# Altium schematic sheet LOOMS.SchDoc
size A4; Organization: Electronic Research & Design; Address1: 11 Granofier; Address2: Zwartkop; Address3: Centurion; Address4: South Africa; Revision: 0
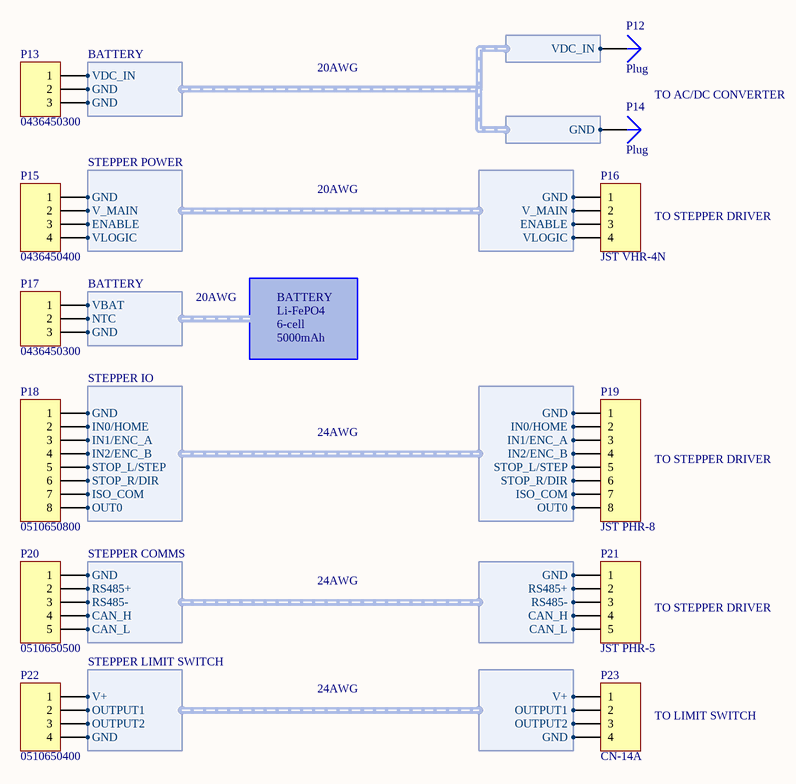
[diagram p0: LOOMS.SchDoc]

## Parts
P12  Plug  [PIN1]
P13  0436450300  [HDR1X3]
P14  Plug  [PIN1]
P15  0436450400  [HDR1X4]
P16  JST VHR-4N  [HDR1X4]
P17  0436450300  [HDR1X3]
P18  0510650800  [HDR1X8]
P19  JST PHR-8  [HDR1X8]
P20  0510650500  [HDR1X5]
P21  JST PHR-5  [HDR1X5]
P22  0510650400  [HDR1X4]
P23  CN-14A  [HDR1X4]

## Harnesses
STEPPER POWER: GND, V_MAIN, ENABLE, VLOGIC
BATTERY: VBAT, NTC, GND
STEPPER IO: OUT0, ISO_COM, STOP_R/DIR, STOP_L/STEP, IN2/ENC_B, IN1/ENC_A, IN0/HOME, GND
STEPPER COMMS: GND, RS485+, RS485-, CAN_H, CAN_L
STEPPER LIMIT SWITCH: V+, OUTPUT1, OUTPUT2, GND
BATTERY: VDC_IN, GND, GND
BATTERY: VDC_IN
BATTERY: GND

## Nets
NetP12_1: P12.1 P13.1 ; harness BATTERY.VDC_IN
NetP13_2: P13.2 P13.3 P14.1 ; harness BATTERY.GND
NetP15_1: P15.1 P16.1 ; harness STEPPER POWER.GND
NetP15_2: P15.2 P16.2 ; harness STEPPER POWER.V_MAIN
NetP15_3: P15.3 P16.3 ; harness STEPPER POWER.ENABLE
NetP15_4: P15.4 P16.4 ; harness STEPPER POWER.VLOGIC
NetP17_1: P17.1 ; harness BATTERY.VBAT
NetP17_2: P17.2 ; harness BATTERY.NTC
NetP17_3: P17.3 ; harness BATTERY.GND
NetP18_1: P18.1 P19.1 ; harness STEPPER IO.GND
NetP18_2: P18.2 P19.2 ; harness STEPPER IO.IN0/HOME
NetP18_3: P18.3 P19.3 ; harness STEPPER IO.IN1/ENC_A
NetP18_4: P18.4 P19.4 ; harness STEPPER IO.IN2/ENC_B
NetP18_5: P18.5 P19.5 ; harness STEPPER IO.STOP_L/STEP
NetP18_6: P18.6 P19.6 ; harness STEPPER IO.STOP_R/DIR
NetP18_7: P18.7 P19.7 ; harness STEPPER IO.ISO_COM
NetP18_8: P18.8 P19.8 ; harness STEPPER IO.OUT0
NetP20_1: P20.1 P21.1 ; harness STEPPER COMMS.GND
NetP20_2: P20.2 P21.2 ; harness STEPPER COMMS.RS485+
NetP20_3: P20.3 P21.3 ; harness STEPPER COMMS.RS485-
NetP20_4: P20.4 P21.4 ; harness STEPPER COMMS.CAN_H
NetP20_5: P20.5 P21.5 ; harness STEPPER COMMS.CAN_L
NetP22_1: P22.1 P23.1 ; harness STEPPER LIMIT SWITCH.V+
NetP22_2: P22.2 P23.2 ; harness STEPPER LIMIT SWITCH.OUTPUT1
NetP22_3: P22.3 P23.3 ; harness STEPPER LIMIT SWITCH.OUTPUT2
NetP22_4: P22.4 P23.4 ; harness STEPPER LIMIT SWITCH.GND

## Notes on the sheet
- 20AWG
- TO AC/DC CONVERTER
- TO STEPPER DRIVER
- BATTERY
- Li-FePO4
- 6-cell
- 5000mAh
- 24AWG
- TO LIMIT SWITCH
- Title:
- Size:
- Date:
- Project:
- A4
- Number:
- Time:
- Revision:
- Sheet
- of
- File:

## Library data of the parts
P13 P17 = Header 3: Receptacle, MicroFit, 3-circuit, 3mm pitch; Manufacturer: Molex; Mating Part: 0436500304; PartNumber: 0436450300
P15 = Header 4: Receptacle, MicroFit, 4-circuit, 3mm pitch; Manufacturer: Molex; Mating Part: 0436500404; Receptacle Socket: 0430300001; PartNumber: 0436450400
P16 = Header 4: Receptacle, 4-circuit, 396mm pitch; Manufacturer: JST Sales America; Mating Part: JST B4P-VH; Receptacle Socket: JST SVH-21T-P1.1; PartNumber: JST VHR-4N
P18 = Header 8: Receptacle, 8-circuit, 2mm pitch; Manufacturer: Molex; Mating Part: 532540870; Receptacle Socket: 0502128000; PartNumber: 0510650800
P19 = Header 8: Receptacle, 8-circuit, 2mm pitch; Manufacturer: JST Sales America; Mating Part: JST B8B-PH-K-S; Receptacle Socket: JST SPH-002T-P0.5S; PartNumber: JST PHR-8
P20 = Header 5: Receptacle, 5-circuit, 2mm pitch; Manufacturer: Molex; Mating Part: 532540570; Receptacle Socket: 0502128000; PartNumber: 0510650500
P21 = Header 5: Receptacle, 5-circuit, 2mm pitch; Manufacturer: JST Sales America; Mating Part: JST B5B-PH-K-S; Receptacle Socket: JST SPH-002T-P0.5S; PartNumber: JST PHR-5
P22 = Header 4: Receptacle, 4-circuit, 2mm pitch; Manufacturer: Molex; Mating Part: 532540470; Receptacle Socket: 0502128000; PartNumber: 0510650400
P23 = Header 4: Receptacle, 4-circuit, 2mm pitch; Manufacturer: Panasonic Industrial Automation; PartNumber: CN-14A
P12 P14 = Plug: LatestRevisionDate: 17-Jul-2002; LatestRevisionNote: Re-released for DXP Platform.; Publisher: Altium Limited